# EAGLE design mpu6050schem (EAGLE 9.6.1)
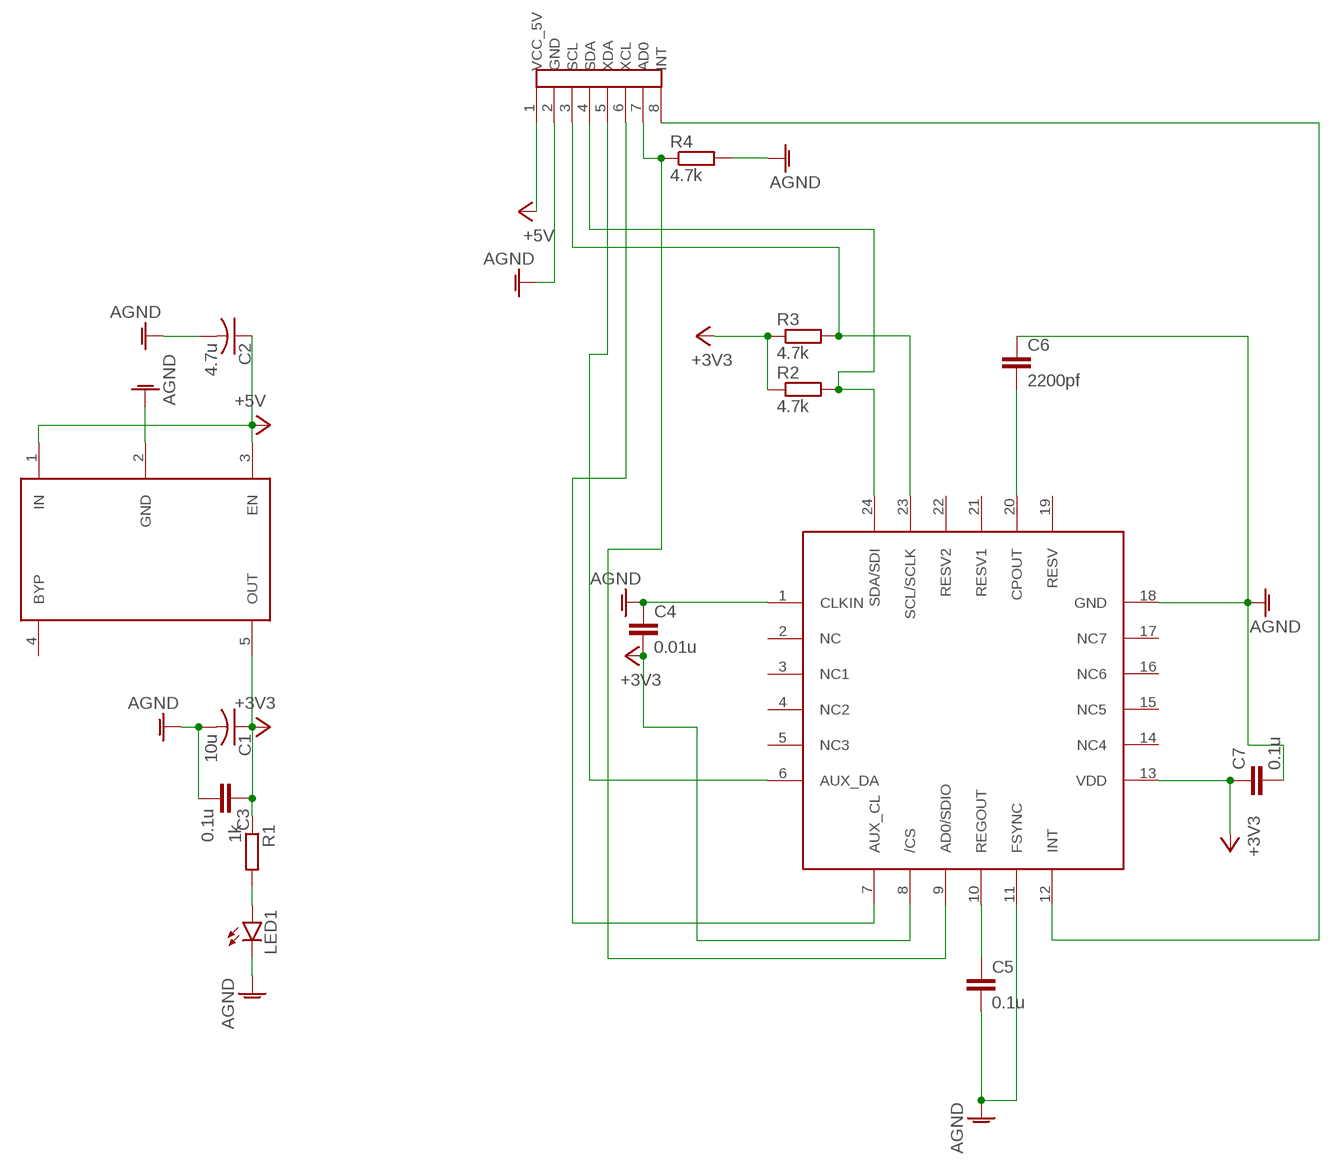
[diagram p0: schematic, sheet 1]

## Parts
C1  10u  C-USC0603  [C0603]
C2  4.7u  C-USC0603  [C0603]
C3  0.1u  C-EUC0402  [C0402]
C4  0.01u  C-EUC0402  [C0402]
C5  0.1u  C-EUC0402  [C0402]
C6  2200pf  C-EUC0402  [C0402]
C7  0.1u  C-EUC0402  [C0402]
LDO3.3V  MIC5219  [SOT95P295X145-5N]
LED1  LEDCHIP-LED0603  [CHIP-LED0603]
R1  1k  R-EU_R0402  [R0402]
R2  4.7k  R-EU_R0402  [R0402]
R3  4.7k  R-EU_R0402  [R0402]
R4  4.7k  R-EU_R0402  [R0402]
U$1  MPU6050  [QFN50P395X395X90-25T265X255N]
U$2  8PINSHEADER  [HDRRA8W64P254_1X8_2032X254X556B]

## Nets
+3V3: C1.1 C3.1 C4.2 C7.1 LDO3.3V.5(OUT) R1.1 R2.1 R3.1 U$1.8(/CS) U$1.13(VDD)
+5V: C2.1 LDO3.3V.1(IN) LDO3.3V.3(EN) U$2.1(VCC_5V)
AGND: C1.2 C2.2 C3.2 C4.1 C5.2 C6.1 C7.2 LDO3.3V.2(GND) LED1.C R4.2 U$1.1(CLKIN) U$1.11(FSYNC) U$1.18(GND) U$2.2(GND)
N$1: LED1.A R1.2
N$2: R2.2 U$1.24(SDA/SDI) U$2.4(SDA)
N$3: R3.2 U$1.23(SCL/SCLK) U$2.3(SCL)
N$4: C5.1 U$1.10(REGOUT)
N$5: C6.2 U$1.20(CPOUT)
N$6: R4.1 U$1.9(AD0/SDIO) U$2.7(AD0)
N$7: U$1.12(INT) U$2.8(INT)
N$8: U$1.6(AUX_DA) U$2.5(XDA)
N$9: U$1.7(AUX_CL) U$2.6(XCL)
Unconnected: LDO3.3V.4(BYP) U$1.2(NC) U$1.3(NC1) U$1.4(NC2) U$1.5(NC3) U$1.14(NC4) U$1.15(NC5) U$1.16(NC6) U$1.17(NC7) U$1.19(RESV) U$1.21(RESV1) U$1.22(RESV2)

## Library data of the parts
C1 C2 = rcl:C-US: CAPACITOR, American symbol; SPICEPREFIX: C
C3-C7 = rcl:C-EU: CAPACITOR, European symbol; SPICEPREFIX: C
LDO3.3V = MIC5219:MIC5219: regulator 3.3 volt
LED1 = led:LED: LED OSRAM: - CHIPLED LG R971, LG N971, LY N971, LG Q971, LY Q971, LO R971, LY R971 LH N974, LH R974 LS Q976, LO Q976, LY Q976 LO Q996 - Hyper CHIPLED LW Q18S LB Q993, LB Q99A, LB R99A - SideLED LS A670, LO A670, LY A670, LG A670, LP A670 LB A673, LV A673, LT A673, LW A673 LH A674 LY A675 LS A676, LA A676, LO A676, LY A676, LW A676 LS A679, LY A679, LG A679 - Hyper Micro SIDELED® LS Y876, LA Y876, LO Y876, LY Y876 LT Y87S - SmartLED LW L88C, LW L88S LB L89C, LB L89S, LG L890 LS L89K, LO L89K, LY L89K LS L896, LA L896, LO L896, LY L896 - TOPLED LS T670, LO T670, LY T670, LG T670, LP T670 LSG T670, LSP T670, LSY T670, LOP T670, LYG T670 LG T671, LOG T671, LSG T671 LB T673, LV T673, LT T673, LW T673 LH T674 LS T676, LA T676, LO T676, LY T676, LB T676, LH T676, LSB T676, LW T676 LB T67C, LV T67C, LT T67C, LS T67K, LO T67K, LY T67K, LW E67C LS E67B, LA E67B, LO E67B, LY E67B, LB E67C, LV E67C, LT E67C LW T67C LS T679, LY T679, LG T679 LS T770, LO T770, LY T770, LG T770, LP T770 LB T773, LV T773, LT T773, LW T773 LH T774 LS E675, LA E675, LY E675, LS T675 LS T776, LA T776, LO T776, LY T776, LB T776 LHGB T686 LT T68C, LB T68C - Hyper Mini TOPLED® LB M676 - Mini TOPLED Santana® LG M470 LS M47K, LO M47K, LY M47K Source: http://www.osram.convergy.de LUXEON: - LUMILED® LXK2-PW12-R00, LXK2-PW12-S00, LXK2-PW14-U00, LXK2-PW14-V00 LXK2-PM12-R00, LXK2-PM12-S00, LXK2-PM14-U00 LXK2-PE12-Q00, LXK2-PE12-R00, LXK2-PE12-S00, LXK2-PE14-T00, LXK2-PE14-U00 LXK2-PB12-K00, LXK2-PB12-L00, LXK2-PB12-M00, LXK2-PB14-N00, LXK2-PB14-P00, LXK2-PB14-Q00 LXK2-PR12-L00, LXK2-PR12-M00, LXK2-PR14-Q00, LXK2-PR14-R00 LXK2-PD12-Q00, LXK2-PD12-R00, LXK2-PD12-S00 LXK2-PH12-R00, LXK2-PH12-S00 LXK2-PL12-P00, LXK2-PL12-Q00, LXK2-PL12-R00 Source: www.luxeon.com KINGBRIGHT: KA-3528ASYC Source: www.kingbright.com
R1-R4 = rcl:R-EU_: RESISTOR, European symbol; SPICEPREFIX: R
U$1 = MPU6050:MPU6050: MEMs Gyroscope
U$2 = mpu6050pinheader:8PINSHEADER: 8 pins header

## Board
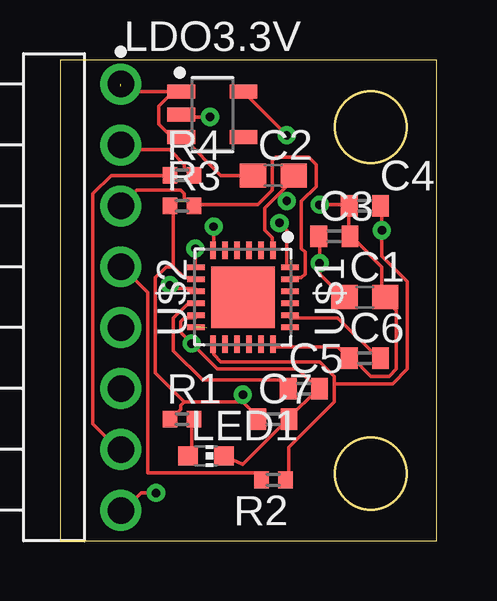
[diagram p1: board, top side]
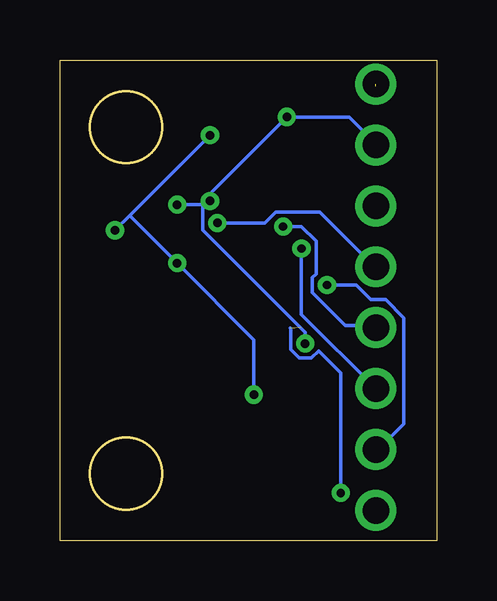
[diagram p2: board, bottom side, seen from below]

Size 15.7 x 20.05 mm. Coordinates in mm from the lower left corner, seen from the top.
Outline: 0,20.05 0,0 15.7,0 15.7,20.05 0,20.05
Outline: circle at 12.95,17.25 radius 1.5
Outline: circle at 12.95,2.8 radius 1.5
Copper layers (1*16): Top 0.035mm / dielectric 1.5mm / Bottom 0.035mm
Design rules "default": minimum track width 6mil, minimum drill 0.35mm, track to track 6mil, track to pad 6mil, pad to pad 6mil, via to via 6mil, smd to smd 6mil, copper to edge 40mil, drill to drill 6mil, minimum pad ring 10mil, minimum via ring 8mil, stop-mask expansion 4mil, vias tented up to drill 0mil, thermal gap 10mil

### Footprints (pad centres in the part's own frame; a part is rotated, then mirrored left to right if it is on the bottom)
C0603 = smd 1.1 x 1: 1 -0.85,0; 2 0.85,0
C0402 = smd 0.7 x 0.9: 1 -0.65,0; 2 0.65,0
SOT95P295X145-5N = smd 1.154 x 0.584: 1 -1.298,0.95; 2 -1.298,0; 3 -1.298,-0.95; 4 1.298,-0.95; 5 1.298,0.95
CHIP-LED0603 = smd 0.8 x 0.8: A 0,-0.75; C 0,0.75
R0402 = smd 0.6 x 0.7: 1 -0.5,0; 2 0.5,0
QFN50P395X395X90-25T265X255N = smd 0.727 x 0.232: 1 -1.961,1.25; 2 -1.961,0.75; 3 -1.961,0.25; 4 -1.961,-0.25; 5 -1.961,-0.75; 6 -1.961,-1.25; 13 1.961,-1.25; 14 1.961,-0.75; 15 1.961,-0.25; 16 1.961,0.25; 17 1.961,0.75; 18 1.961,1.25 | smd 0.232 x 0.727: 7 -1.25,-1.961; 8 -0.75,-1.961; 9 -0.25,-1.961; 10 0.25,-1.961; 11 0.75,-1.961; 12 1.25,-1.961; 19 1.25,1.961; 20 0.75,1.961; 21 0.25,1.961; 22 -0.25,1.961; 23 -0.75,1.961; 24 -1.25,1.961 | smd 2.55 x 2.65: 25 0,0
HDRRA8W64P254_1X8_2032X254X556B = drill 1.105 pad 1.705: 1 -8.89,0; 2 -6.35,0; 3 -3.81,0; 4 -1.27,0; 5 1.27,0; 6 3.81,0; 7 6.35,0; 8 8.89,0

### Placement (x,y rotation side)
C1  12.7,10.16 0 top
C2  8.89,15.24 0 top
C3  11.43,12.7 0 top
C4  12.7,13.97 0 top
C5  10.16,6.35 0 top
C6  12.7,7.62 0 top
C7  8.89,5.08 0 top
LDO3.3V  6.35,17.78 0 top
LED1  6.08,3.54 270 top
R1  5.08,5.08 0 top
R2  8.89,2.54 180 top
R3  5.08,13.97 0 top
R4  5.08,15.24 0 top
U$1  7.62,10.16 270 top
U$2  2.54,10.16 270 top

### Tracks (layer width: path | path; a pad name or v marks a point on that pad's centre or on a via)
+3V3  (via drill 0.35)
  Top 0.152: 4.72,11.43 4.72,13.87 R3.1 | 4.72,11.43 5.18,10.97 5.64,10.97 U$1.8 | 5.18,5.79 5.03,5.64 5.03,5.49 4.72,5.18 R1.1 | 7.62,5.79 5.18,5.79 | 7.62,5.79 8.23,5.18 C7.1 | 4.72,11.43 4.42,11.43 3.96,10.97 3.96,7.01 5.18,5.79 | C3.1 10.82,12.65 v10.82,11.58 10.82,11.12 11.73,10.21 C1.1 | R2.1 9.53,2.68 9.53,3.9 11.43,5.79 11.43,6.55 | 11.43,6.55 11.43,6.86 10.82,7.47 6.71,7.47 6.4,7.77 6.4,8.08 U$1.13 | 11.43,6.55 13.87,6.55 14.48,7.16 14.48,10.82 13.41,11.89 v13.41,12.95 13.41,13.87 C4.2 | v9.45,16.92 7.77,18.59 LDO3.3V.5 | v7.62,6.1 7.62,5.79
  Bottom 0.152: v13.41,12.95 12.8,13.56 | 12.8,13.56 v9.45,16.92 | 12.8,13.56 v10.82,11.58 7.62,8.38 v7.62,6.1
+5V  (1 unrouted)
  Top 0.152: C2.1 6.71,15.24 5.18,16.76 LDO3.3V.3 5.03,16.92 4.57,16.92 4.12,17.37 4.12,18.14 4.57,18.59 5.03,18.59 LDO3.3V.1 2.86,18.73 2.63,18.96 2.54,18.96
AGND  (via drill 0.35)
  Top 0.152: LED1.C 7.61,3.19 9.45,5.03 C7.2 9.6,5.18 10.67,6.25 C5.2 10.67,6.4 9.91,7.16 6.55,7.16 v5.49,8.23 5.03,8.69 5.03,9.14 5.18,9.3 5.64,9.3 U$1.11 | U$1.18 8.84,8.08 11.58,8.08 C6.1 12.19,7.62 12.95,6.86 13.72,6.86 14.02,7.16 14.02,9.6 13.56,10.06 C1.2 13.41,10.21 13.41,11.43 12.19,12.65 C3.2 12.04,12.8 12.04,13.87 C4.1 12.04,14.02 v10.82,14.02 | 9.14,14.48 9.6,14.94 9.6,15.24 C2.2 | 9.14,14.48 8.53,13.87 8.53,12.95 8.84,12.65 8.84,12.19 U$1.1 | U$2.2 2.74,16.31 4.57,16.31 5.18,15.7 5.18,15.54 5.49,15.24 R4.2 | v6.25,17.68 5.18,17.68 LDO3.3V.2 | v9.45,14.17 9.14,14.48
  Bottom 0.152: U$2.2 2.59,16.61 3.66,17.68 v6.25,17.68 9.45,14.48 v9.45,14.17 | 9.75,14.02 9.6,14.02 v9.45,14.17 | 9.75,14.02 v10.82,14.02 | v5.49,8.23 5.49,8.69 9.75,12.95 9.75,14.02 | 9.75,14.02 v9.45,14.17
N$1
  Top 0.152: R1.2 5.49,5.03 5.49,3.66 5.42,3.59 LED1.A
N$2  (via drill 0.35)
  Top 0.152: R2.2 8.32,2.83 3.66,2.83 3.66,10.36 2.59,11.43 U$2.4 | v9.14,13.26 9.45,12.95 9.45,11.43 U$1.24
  Bottom 0.152: v9.14,13.26 7.16,13.26 6.71,13.72 4.88,13.72 2.59,11.43 U$2.4
N$3
  Top 0.152: U$2.3 3.2,14.63 5.03,14.63 5.18,14.48 5.18,14.33 5.49,14.02 R3.2 5.64,14.02 8.23,14.02 8.84,14.63 8.84,15.85 8.99,16 10.36,16 10.67,15.7 10.67,14.78 10.06,14.17 10.06,12.19 10.21,12.04 10.21,11.12 10.06,10.97 9.6,10.97 U$1.23
N$4
  Top 0.152: U$1.10 5.64,9.91 5.33,9.91 4.72,9.3 4.72,7.92 5.94,6.71 9.14,6.71 9.45,6.4 C5.1
N$5
  Top 0.152: U$1.20 9.6,9.3 11.58,9.3 13.26,7.62 C6.2
N$6  (via drill 0.35)
  Top 0.152: R4.1 2.13,15.24 1.37,14.48 1.37,4.88 2.44,3.81 U$2.7 | v4.57,10.67 4.72,10.52 5.64,10.52 U$1.9
  Bottom 0.152: v4.57,10.67 3.35,10.67 2.74,10.06 2.13,10.06 1.37,9.3 1.37,4.88 2.44,3.81 U$2.7
N$7  (via drill 0.35)  (1 unrouted)
  Top 0.152: U$2.8 2.66,1.27 3.39,2 v4,2
  Bottom 0.152: v4,2 4,7 4.93,7.93 5.24,7.62 5.74,7.62 6.09,7.98 6.09,8.86 6.12,8.88
N$8  (via drill 0.35)
  Top 0.152: v6.4,13.11 6.4,12.19 U$1.6
  Bottom 0.152: v6.4,13.11 5.64,13.11 5.03,12.5 5.03,11.12 5.18,10.97 5.18,10.36 3.81,8.99 2.59,8.99 U$2.5
N$9  (via drill 0.35)
  Top 0.152: v5.64,12.19 5.64,11.43 U$1.7
  Bottom 0.152: v5.64,12.19 5.64,9.45 U$2.6